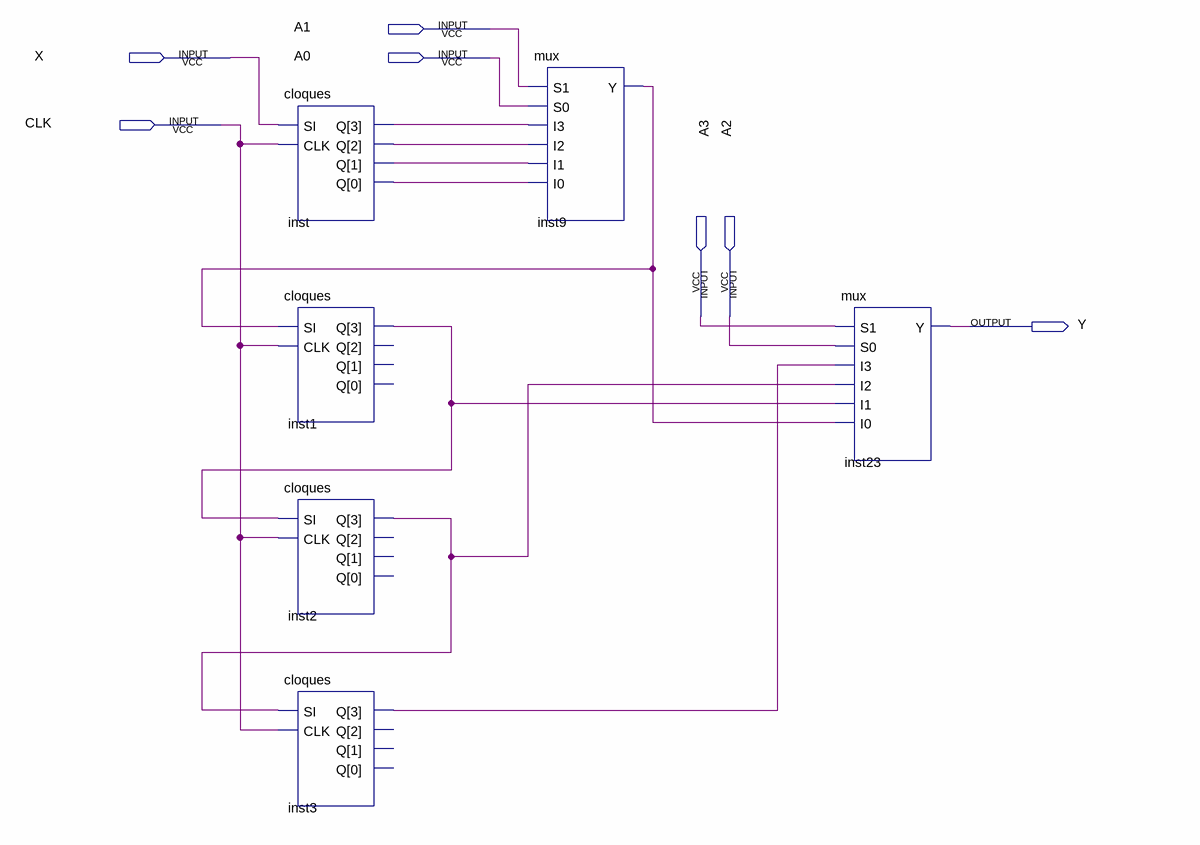
[diagram p0: schematic sheet]
// Quartus schematic clockexe.bdf as structural Verilog: 6 symbols, 7 pins
module clockexe (
  input  A1,
  input  X,
  input  A0,
  input  CLK,
  input  A3,
  input  A2,
  output Y
);

  wire inst1_q, inst2_q, inst3_q, inst9_y, inst_q, inst_q_2, inst_q_3, inst_q_4;
  wire [3:0] inst3_q_open;  // unused outputs
  wire [3:0] inst2_q_open;  // unused outputs
  wire [3:0] inst1_q_open;  // unused outputs

  cloques inst (.SI(X), .CLK(CLK), .Q({inst_q_4, inst_q_3, inst_q_2, inst_q}));
  cloques inst1 (.SI(inst9_y), .CLK(CLK), .Q({inst1_q, inst1_q_open[2:0]}));
  cloques inst2 (.SI(inst1_q), .CLK(CLK), .Q({inst2_q, inst2_q_open[2:0]}));
  cloques inst3 (.SI(inst2_q), .CLK(CLK), .Q({inst3_q, inst3_q_open[2:0]}));
  mux inst9 (.S1(A1), .S0(A0), .I3(inst_q_4), .I2(inst_q_3), .I1(inst_q_2), .I0(inst_q), .Y(inst9_y));
  mux inst23 (.S1(A3), .S0(A2), .I3(inst3_q), .I2(inst2_q), .I1(inst1_q), .I0(inst9_y), .Y(Y));
endmodule
